# Altium project Smartstrap_small_PMIC.PrjPcb
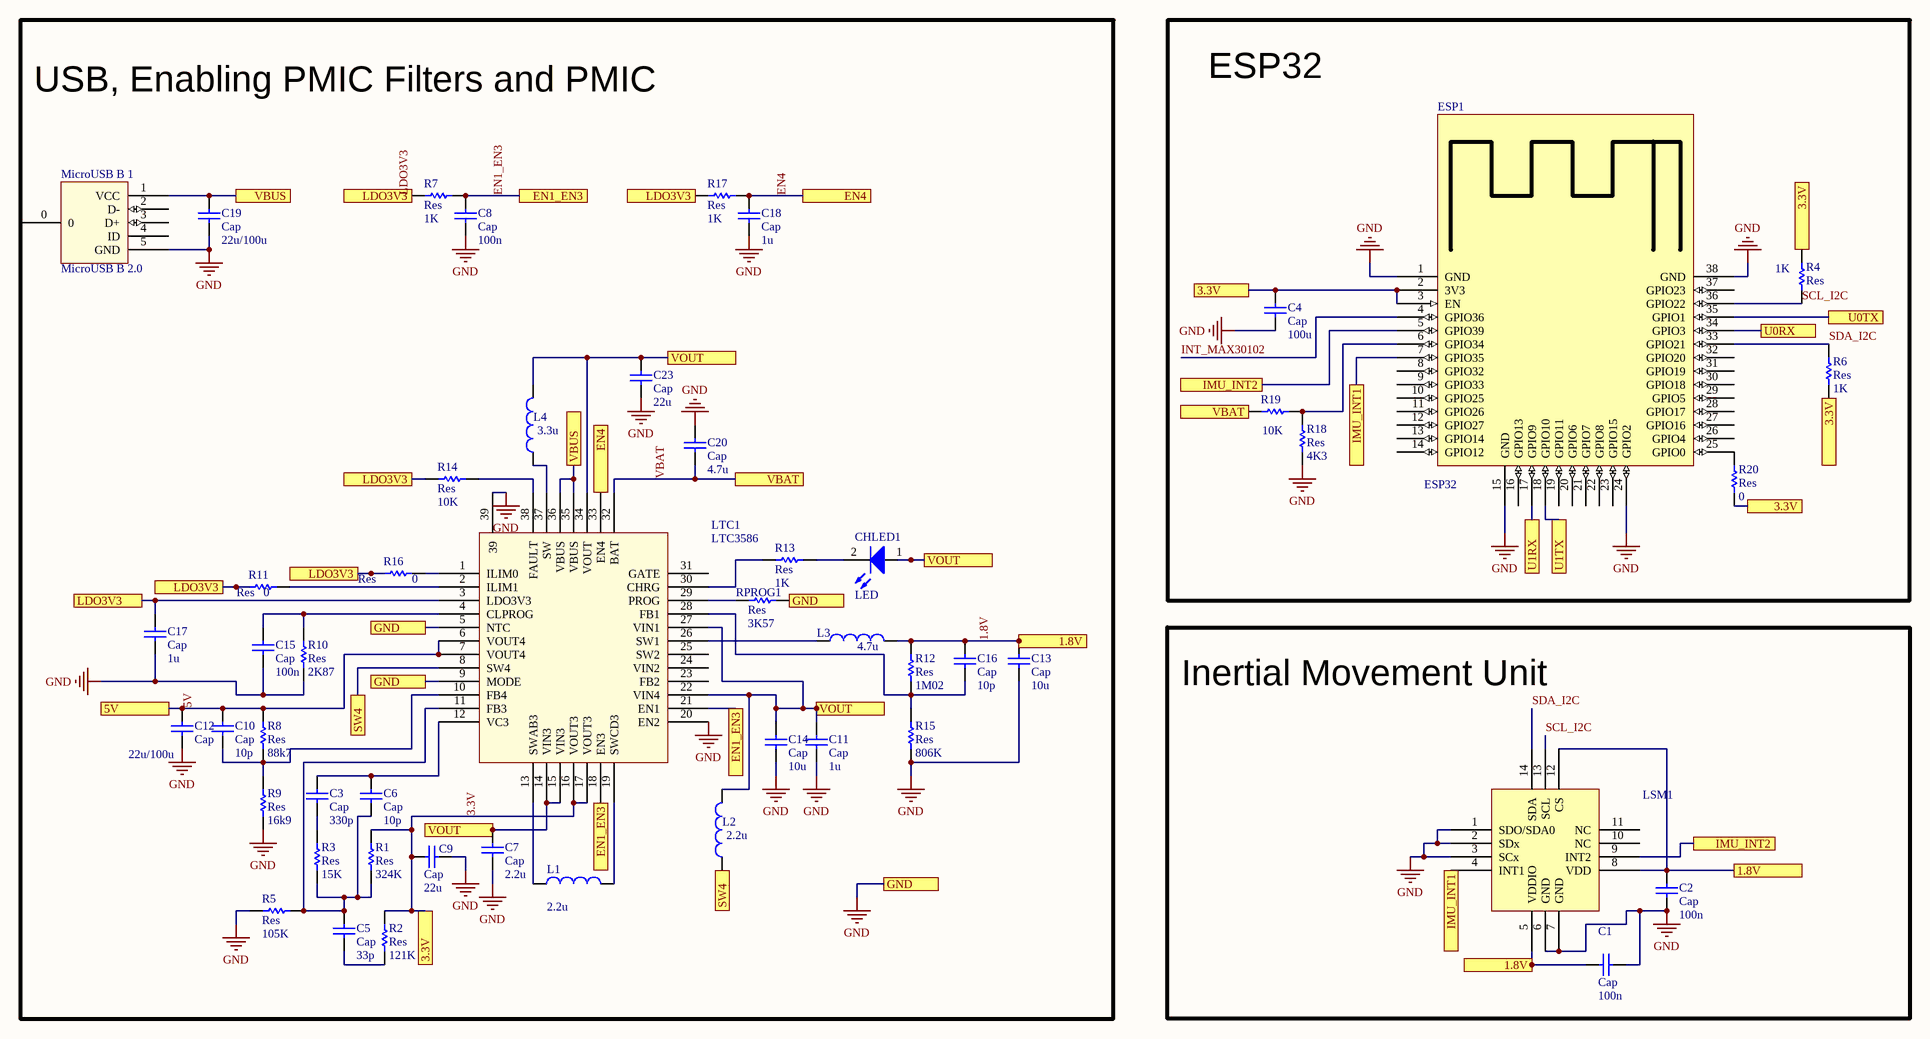
[diagram p0: MainDesign_small.SchDoc]
1 sheet, 51 parts. Net scope: flat (ports and power ports of the same name join across sheets).
Board file: MainDesign_Small.PcbDoc

## Sheet MainDesign_small.SchDoc
size A2

### Parts
C1  Cap  value 100n  [0402 CAP]
C2  Cap  value 100n  [0402 CAP]
C3  Cap  value 330p  [0402 CAP]
C4  Cap  value 100u  [0402 CAP]
C5  Cap  value 33p  [0402 CAP]
C6  Cap  value 10p  [0402 CAP]
C7  Cap  value 2.2u  [0402 CAP]
C8  Cap  value 100n  [0402 CAP]
C9  Cap  value 22u  [0402 CAP]
C10  Cap  value 10p  [0402 CAP]
C11  Cap  value 1u  [0402 CAP]
C12  Cap  value 22u/100u  [0402 CAP]
C13  Cap  value 10u  [0402 CAP]
C14  Cap  value 10u  [0402 CAP]
C15  Cap  value 100n  [0402 CAP]
C16  Cap  value 10p  [0402 CAP]
C17  Cap  value 1u  [0402 CAP]
C18  Cap  value 1u  [0402 CAP]
C19  Cap  value 22u/100u  [0402 CAP]
C20  Cap  value 4.7u  [0402 CAP]
C23  Cap  value 22u  [0402 CAP]
CHLED1  LED  [0603 LED-BLUE]
ESP1  ESP32  [ESP32]
L1  value 2.2u  [Inductor 0806 [2016]]  (hidden comment: L?)
L2  value 2.2u  [Inductor 0806 [2016]]  (hidden comment: L?)
L3  value 4.7u  [Inductor 0806 [2016]]  (hidden comment: L?)
L4  value 3.3u  [Inductor 1008 [2520]]  (hidden comment: L?)
LSM1  LSM6DS3  [LSM6DS3]  (value not drawn)
LTC1  LTC3586  [LTC3586/LTC3586-1]
MicroUSB_B_1  MicroUSB B 2.0  [MicroUSB B 2.0]
R1  Res  value 324K  [0402 Res]
R2  Res  value 121K  [0402 Res]
R3  Res  value 15K  [0402 Res]
R4  Res  value 1K  [0402 Res]
R5  Res  value 105K  [0402 Res]
R6  Res  value 1K  [0402 Res]
R7  Res  value 1K  [0402 Res]
R8  Res  value 88k7  [0402 Res]
R9  Res  value 16k9  [0402 Res]
R10  Res  value 2K87  [0402 Res]
R11  Res  value 0  [0402 Res]
R12  Res  value 1M02  [0402 Res]
R13  Res  value 1K  [0402 Res]
R14  Res  value 10K  [0402 Res]
R15  Res  value 806K  [0402 Res]
R16  Res  value 0  [0402 Res]
R17  Res  value 1K  [0402 Res]
R18  Res  value 4K3  [0402 Res]
R19  value 10K  [0402 Res]  (hidden comment: Res)
R20  Res  value 0  [0402 Res]
RPROG1  Res  value 3K57  [0402 Res]

### Blocks framed on the sheet
USB, Enabling PMIC Filters and PMIC: C3 C5-C20 C23 CHLED1 L1-L4 LTC1 MicroUSB_B_1 R1-R3 R5 R7-R17 RPROG1
ESP32: C4 ESP1 R4 R6 R18-R20
Inertial Movement Unit: C1 C2 LSM1

### Ports
1.8V, 3.3V, 5V, EN1_EN3, EN4, GND, IMU_INT1, IMU_INT2, LDO3V3, SW4, U0RX, U0TX, U1RX, U1TX, VBAT, VBUS, VOUT

### Nets
GND: C1.1 C2.1 C4.1 C7.1 C8.1 C9.1 C11.2 C12.1 C13.1 C14.1 C15.1 C17.1 C18.1 C19.1 C20.2 C23.1 ESP1.1(GND) ESP1.15(GND) ESP1.24(GPIO2) ESP1.38(GND) LSM1.1(SDO/SDA0) LSM1.2(SDx) LSM1.3(SCx) LSM1.6(GND) LSM1.7(GND) LTC1.5(NTC) LTC1.9(MODE) LTC1.20(EN2) LTC1.39 MicroUSB_B_1.5(GND) R5.2 R9.2 R10.2 R15.2 R18.2 RPROG1.2 ; port GND
1.8V: C1.2 C2.2 C13.2 C16.2 L3.2 LSM1.5(VDDIO) LSM1.8(VDD) LSM1.12(CS) R12.1 ; port 1.8V
3.3V: C4.2 C9.2 ESP1.2(3V3) ESP1.3(EN) LTC1.16(VOUT3) LTC1.17(VOUT3) R1.2 R2.2 R4.1 R6.2 R20.2 ; port 3.3V
5V: C10.2 C12.2 LTC1.6(VOUT4) LTC1.7(VOUT4) R8.1 ; port 5V
EN1_EN3: C8.2 LTC1.18(EN3) LTC1.21(EN1) R7.2 ; port EN1_EN3
EN4: C18.2 LTC1.33(EN4) R17.2 ; port EN4
INT_MAX30102: ESP1.4(GPIO36)
LDO3V3: C17.2 LTC1.3(LDO3V3) R7.1 R11.1 R14.1 R16.1 R17.1 ; port LDO3V3
SCL_I2C: ESP1.36(GPIO22) LSM1.13(SCL) R4.2
SDA_I2C: ESP1.33(GPIO21) LSM1.14(SDA) R6.1
VBAT: C20.1 LTC1.32(BAT) R19.1 ; port VBAT
NetC3_1: C3.1 R3.1
NetC3_2: C3.2 C6.2 LTC1.12(VC3)
NetC5_1: C5.1 R2.1
NetC5_2: C5.2 C6.1 LTC1.11(FB3) R1.1 R3.2 R5.1
NetC7_2: C7.2 C11.1 C14.2 C23.2 CHLED1.1(A) L2.2 L4.2 LTC1.14(VIN3) LTC1.15(VIN3) LTC1.22(VIN4) LTC1.27(VIN1) LTC1.34(VOUT) ; port VOUT
NetC10_1: C10.1 LTC1.10(FB4) R8.2 R9.1
NetC15_2: C15.2 LTC1.4(CLPROG) R10.1
NetC16_1: C16.1 LTC1.28(FB1) R12.2 R15.1
NetC19_2: C19.2 LTC1.35(VBUS) LTC1.36(VBUS) MicroUSB_B_1.1(VCC) ; port VBUS
NetCHLED1_2: CHLED1.2(C) R13.2
NetESP1_5: ESP1.5(GPIO39) LSM1.9(INT2) ; port IMU_INT2
NetESP1_6: ESP1.6(GPIO34) R18.1 R19.2
NetESP1_7: ESP1.7(GPIO35) LSM1.4(INT1) ; port IMU_INT1
NetESP1_17: ESP1.17(GPIO9) ; port U1RX
NetESP1_18: ESP1.18(GPIO10) ; port U1TX
NetESP1_25: ESP1.25(GPIO0) R20.1
NetESP1_34: ESP1.34(GPIO3) ; port U0RX
NetESP1_35: ESP1.35(GPIO1) ; port U0TX
NetL1_1: L1.1 LTC1.13(SWAB3)
NetL1_2: L1.2 LTC1.19(SWCD3)
NetL2_1: L2.1 LTC1.8(SW4) ; port SW4
NetL3_1: L3.1 LTC1.26(SW1)
NetL4_1: L4.1 LTC1.37(SW)
NetLTC1_1: LTC1.1(ILIM0) R16.2
NetLTC1_2: LTC1.2(ILIM1) R11.2
NetLTC1_29: LTC1.29(PROG) RPROG1.1
NetLTC1_30: LTC1.30(CHRG) R13.1
NetLTC1_38: LTC1.38(FAULT) R14.2

Not connected (* = marked no-connect by the designer): ESP1 8(GPIO32) 9(GPIO33) 10(GPIO25) 11(GPIO26) 12(GPIO27) 13(GPIO14) 14(GPIO12) 16(GPIO13) 19(GPIO11) 20(GPIO6) 21(GPIO7) 22(GPIO8) 23(GPIO15) 26(GPIO4) 27(GPIO16) 28(GPIO17) 29(GPIO5) 30(GPIO18) 31(GPIO19) 32(GPIO20) 37(GPIO23); LSM1 10(NC) 11(NC); LTC1 23(FB2) 24(VIN2) 25(SW2) 31(GATE); MicroUSB_B_1 0 2(D-) 3(D+) 4(ID)

### Library data of the parts
L1-L4 = Ind
LTC1 = LTC3586/LTC3586-1
LSM1 = LSM6DS3: Supplier 1: Digi-Key; Supplier Part Number 1: 497-15383-1-ND